# EAGLE design rs232 (EAGLE 6.2)
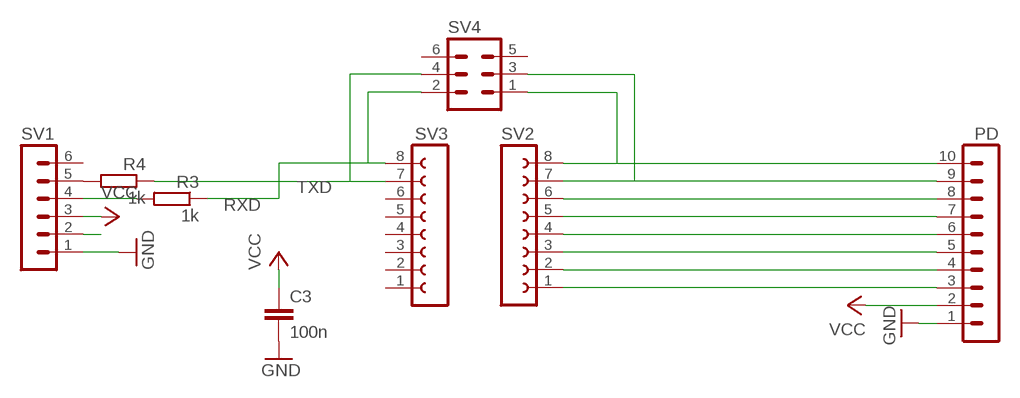
[diagram p0: schematic, sheet 1]

## Parts
C3  100n  C-EU025-024X044  [C025-024X044]
PD  MA10-1W  [MA10-1W]
R3  1k  R-EU_0207/12  [0207/12]
R4  1k  R-EU_0207/12  [0207/12]
SV1  MA06-1  [MA06-1]
SV2  FE08-1  [FE08]
SV3  FE08-1  [FE08]
SV4  MA03-2  [MA03-2]

## Nets
GND: C3.2 PD.1 SV1.1
N$1: PD.5 SV2.3
N$2: SV1.2
N$3: PD.3 SV2.1
N$4: PD.10 SV2.8 SV4.1
N$5: PD.9 SV2.7 SV4.3
N$9: R3.2 SV1.4
N$10: R4.2 SV1.5
N$11: PD.8 SV2.6
N$12: PD.7 SV2.5
N$14: PD.6 SV2.4
N$16: PD.4 SV2.2
RXD: R3.1 SV3.8 SV4.2
TXD: R4.1 SV3.7 SV4.4
VCC: C3.1 PD.2 SV1.3
Unconnected: SV1.6 SV3.1 SV3.2 SV3.3 SV3.4 SV3.5 SV3.6 SV4.5 SV4.6

## Library data of the parts
C3 = rcl:C-EU: CAPACITOR, European symbol
PD = con-lstb:MA10-1W: PIN HEADER
R3 R4 = rcl:R-EU_: RESISTOR, European symbol
SV1 = con-lstb:MA06-1: PIN HEADER
SV2 SV3 = con-lsta:FE08-1: FEMALE HEADER
SV4 = con-lstb:MA03-2: PIN HEADER

## Board
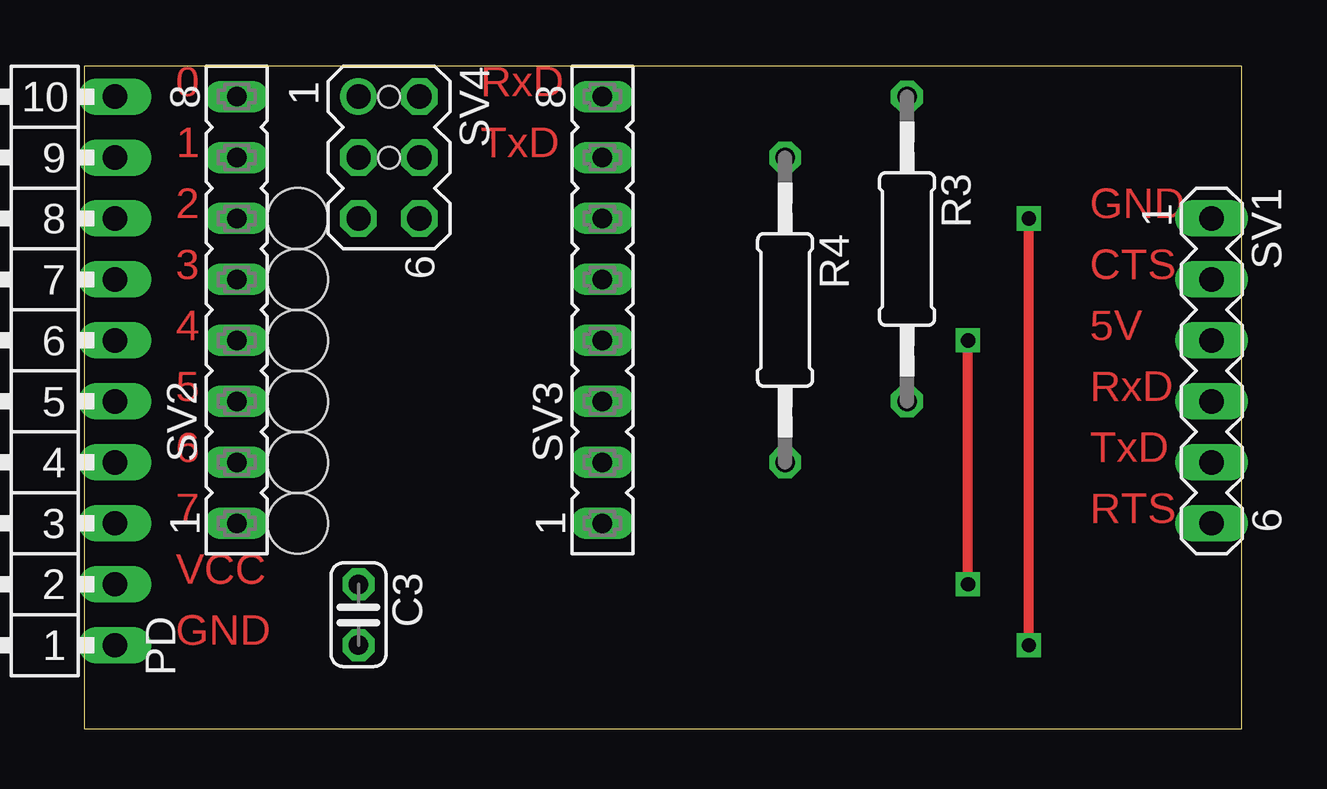
[diagram p1: board, top side]
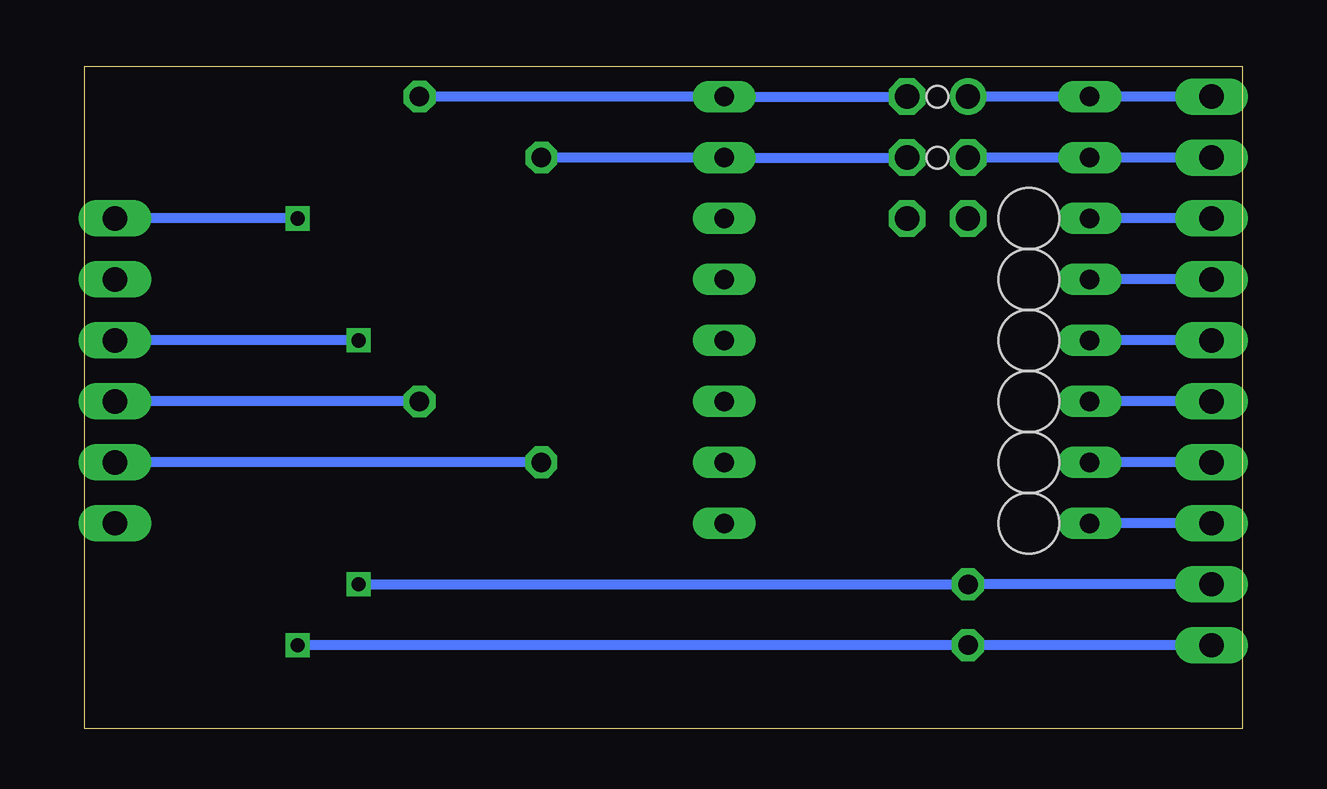
[diagram p2: board, bottom side, seen from below]

Size 48.25 x 27.61 mm. Coordinates in mm from the lower left corner, seen from the top.
Outline: 0,27.61 0,0 48.25,0 48.25,27.61 0,27.61
Copper layers (1*16): Top 0.035mm / dielectric 1.5mm / Bottom 0.035mm
Design rules: minimum track width 10mil, minimum drill 24mil, track to track 8mil, track to pad 8mil, pad to pad 8mil, via to via 8mil, smd to smd 8mil, copper to edge 40mil, drill to drill 8mil, minimum pad ring 10mil, minimum via ring 8mil, stop-mask expansion 4mil, vias tented up to drill 0mil, thermal gap 10mil
Holes 2.54 mm at 8.89,21.26 8.89,18.72 8.89,16.18 8.89,13.64 8.89,11.1 8.89,8.56
Holes 0.9 mm at 12.7,26.34 12.7,23.8

### Footprints (pad centres in the part's own frame; a part is rotated, then mirrored left to right if it is on the bottom)
C025-024X044 = drill 0.813 octagon: 1 -1.27,0; 2 1.27,0
MA10-1W = drill 1.016 long: 1 -11.43,0; 2 -8.89,0; 3 -6.35,0; 4 -3.81,0; 5 -1.27,0; 6 1.27,0; 7 3.81,0; 8 6.35,0; 9 8.89,0; 10 11.43,0
0207/12 = drill 0.813 octagon: 1 -6.35,0; 2 6.35,0
MA06-1 = drill 1.016 long: 1 -6.35,0; 2 -3.81,0; 3 -1.27,0; 4 1.27,0; 5 3.81,0; 6 6.35,0
FE08 = drill 0.813 long: 1 -8.89,0; 2 -6.35,0; 3 -3.81,0; 4 -1.27,0; 5 1.27,0; 6 3.81,0; 7 6.35,0; 8 8.89,0
MA03-2 = drill 1.016: 1 -2.54,-1.27 | drill 1.016 octagon: 2 -2.54,1.27; 3 0,-1.27; 4 0,1.27; 5 2.54,-1.27; 6 2.54,1.27

### Placement (x,y rotation side)
C3  11.43,4.75 270 top
PD  1.27,14.91 90 top
R3  34.29,19.99 270 top
R4  29.21,17.45 270 top
SV1  46.99,14.91 270 top
SV2  6.35,17.45 90 top
SV3  21.59,17.45 90 top
SV4  12.7,23.8 270 top

### Tracks (layer width: path | path; a pad name or v marks a point on that pad's centre or on a via)
GND  (via drill 0.6)
  Top 0.406: v39.37,3.48 v39.37,21.26
  Bottom 0.406: PD.1 C3.2 v39.37,3.48 | v39.37,21.26 SV1.1
N$1
  Bottom 0.406: PD.5 SV2.3
N$3
  Bottom 0.406: PD.3 SV2.1
N$4
  Bottom 0.406: PD.10 SV2.8 SV4.1
N$5
  Bottom 0.406: PD.9 SV2.7 SV4.3
N$9
  Bottom 0.406: R3.2 SV1.4
N$10
  Bottom 0.406: R4.2 SV1.5
N$11
  Bottom 0.406: PD.8 SV2.6
N$12
  Bottom 0.406: PD.7 SV2.5
N$14
  Bottom 0.406: PD.6 SV2.4
N$16
  Bottom 0.406: PD.4 SV2.2
RXD
  Bottom 0.406: R3.1 SV3.8 SV4.2
TXD
  Bottom 0.406: R4.1 SV3.7 SV4.4
VCC  (via drill 0.6)
  Top 0.406: v36.83,6.02 v36.83,16.18
  Bottom 0.406: PD.2 C3.1 v36.83,6.02 | v36.83,16.18 SV1.3

### Text on the board
Top: 0 | RxD | 1 | TxD | 2 | GND | 3 | CTS | 4 | 5V | 5 | RxD | 6 | TxD | 7 | RTS | VCC | GND